# EAGLE board Main_Board (EAGLE 7.7.0)
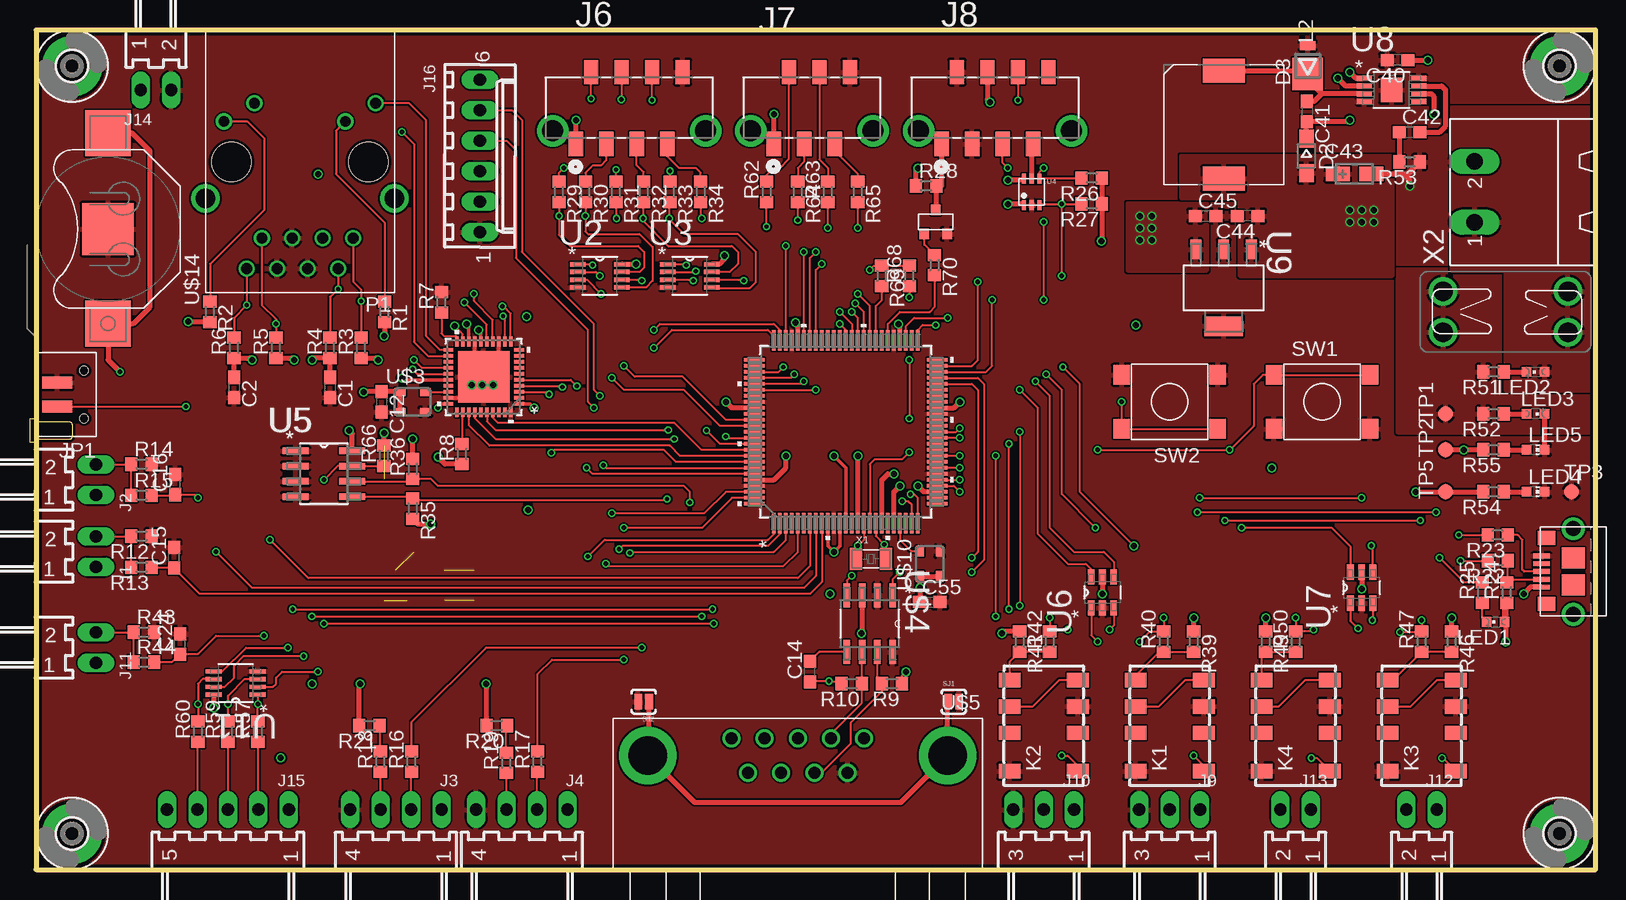
[diagram p5: board, top side]
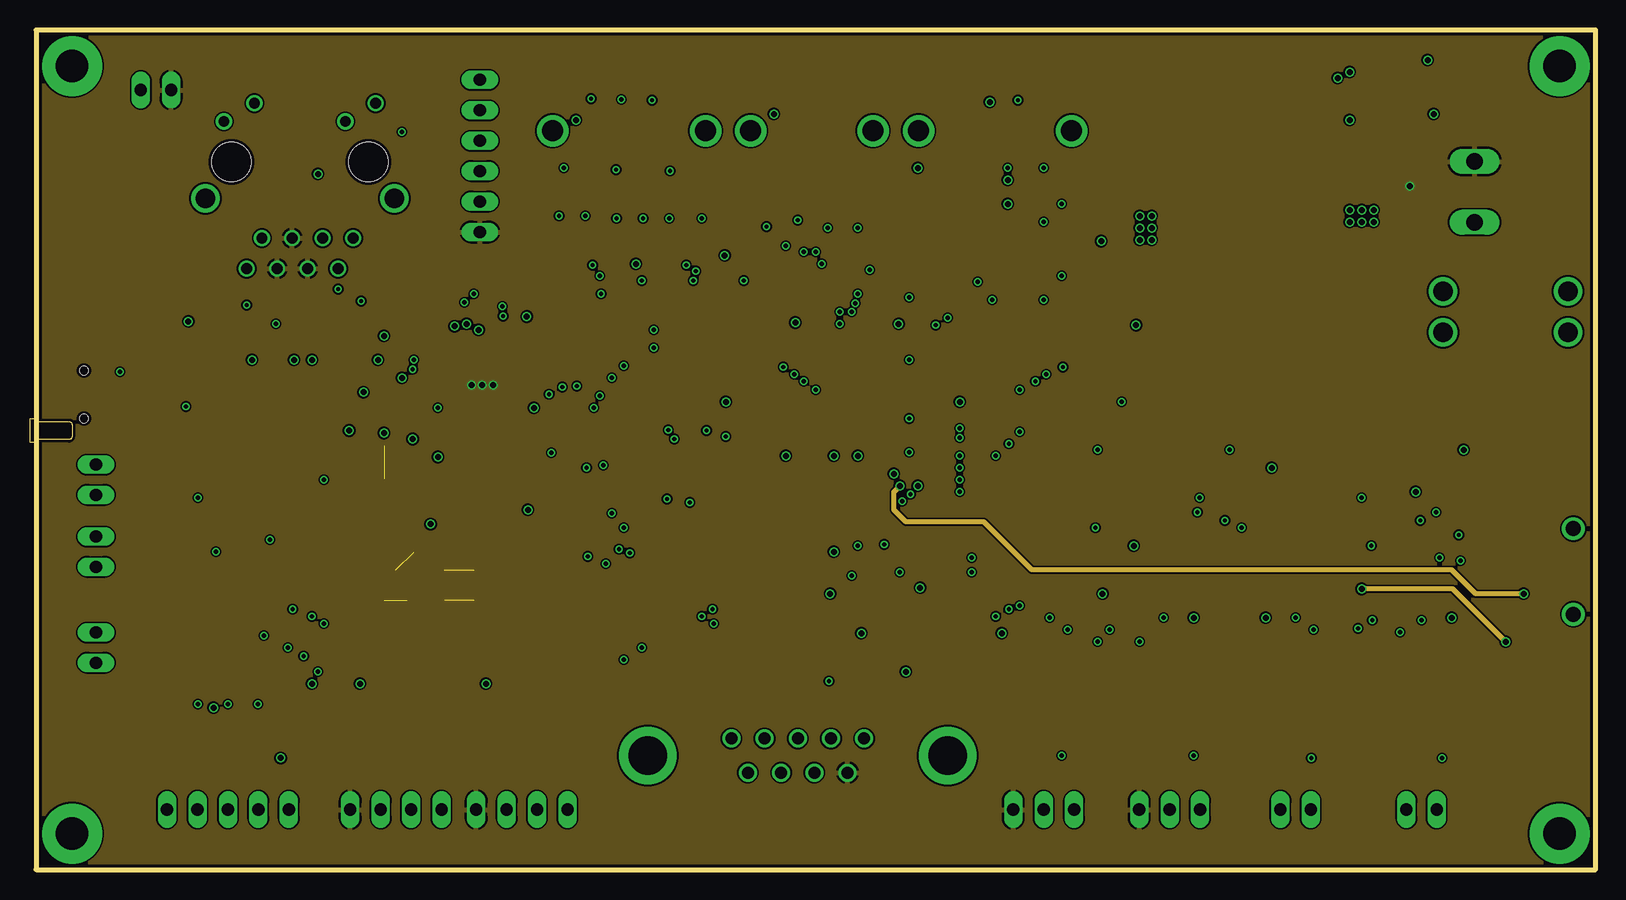
[diagram p6: board, inner layer Route2]
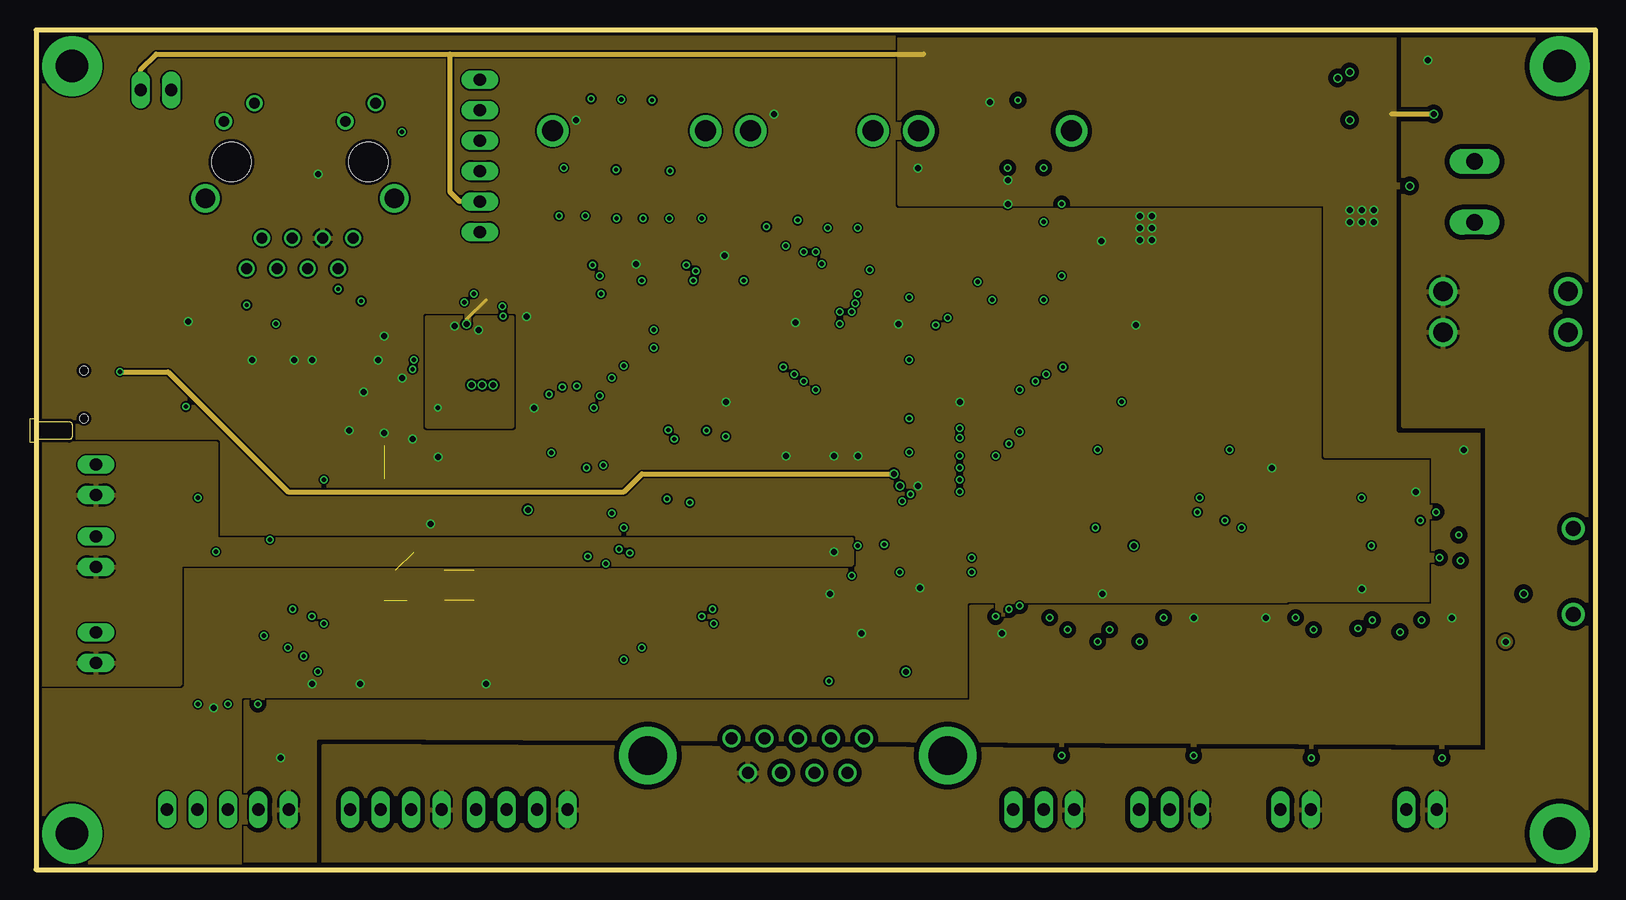
[diagram p7: board, inner layer Route3]
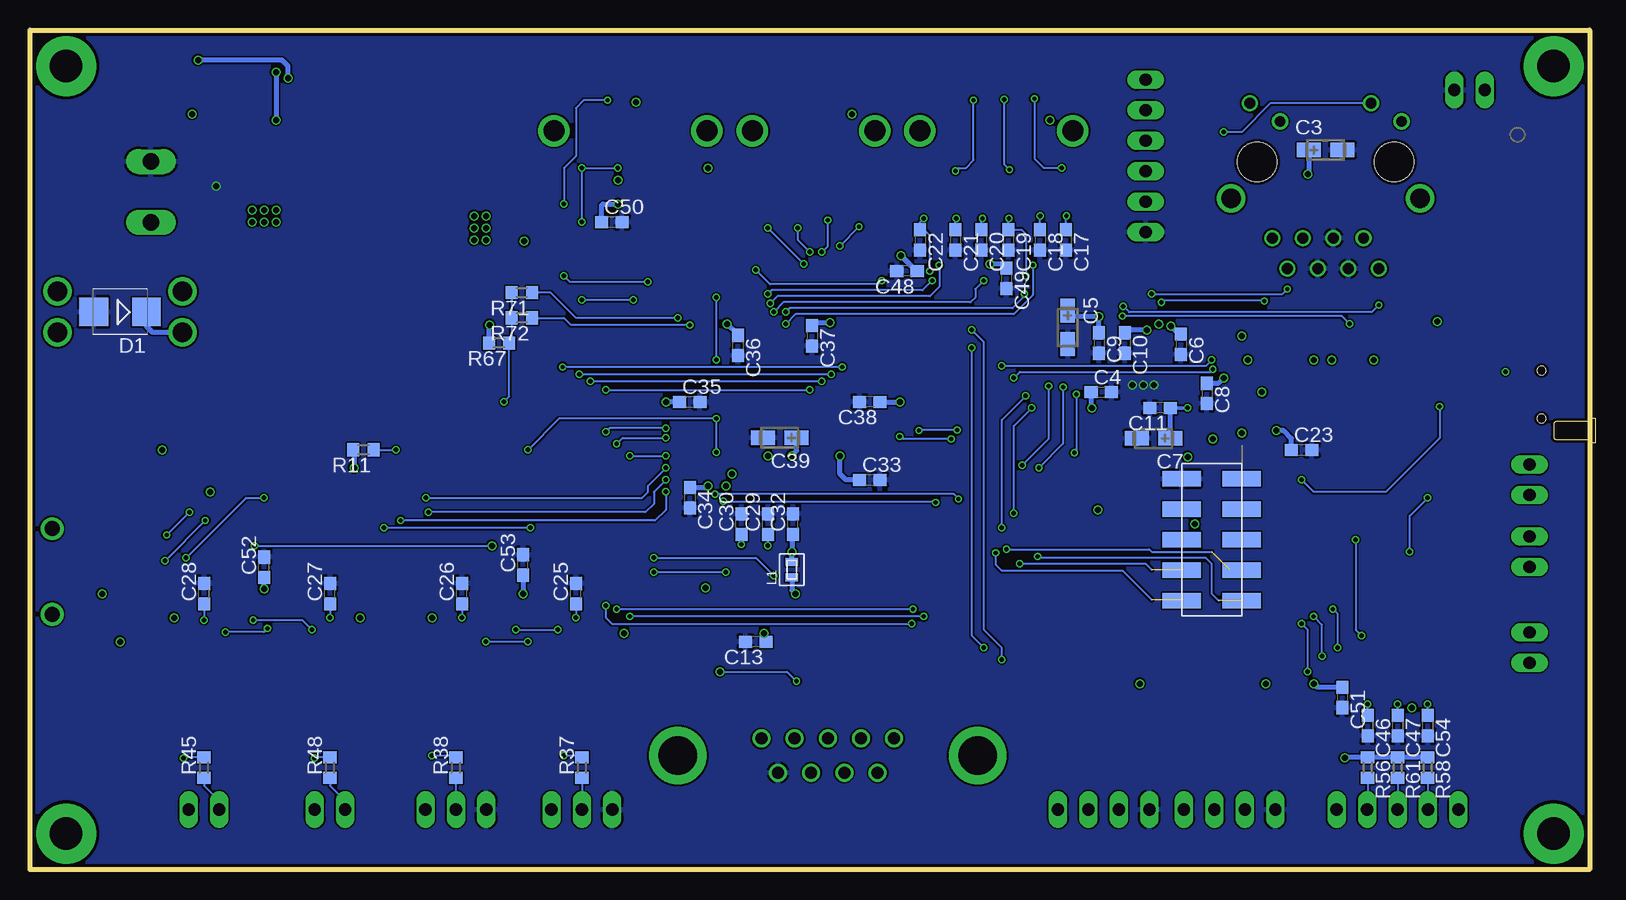
[diagram p8: board, bottom side, seen from below]

Size 130 x 70 mm. Coordinates in mm from the lower left corner, seen from the top.
Outline: 0,0 130,0 130,70 0,70 0,0
Copper layers (1+2*3+16): Top 0.018mm / dielectric 0.36mm / Route2 0.035mm / dielectric 0.71mm / Route3 0.035mm / dielectric 0.36mm / Bottom 0.018mm
Design rules "eC_4Layer_PClass6_BaseCopperO18-I35_eCDefault *": minimum track width 0.15mm, minimum drill 0.35mm, track to track 0.15mm, track to pad 0.15mm, pad to pad 0.15mm, via to via 0.15mm, smd to smd 0mil, copper to edge 0.25mm, drill to drill 0.35mm, minimum pad ring 0.175mm, minimum via ring 0.125mm, stop-mask expansion 0mil, vias tented up to drill 0.45mm, thermal gap 0.2mm
Net classes: 1 signal: width 0.178 mm, drill 0.35 mm; 2 supply: width 0.008 mm, drill 0.5 mm

## Footprints (pad centres in the part's own frame; a part is rotated, then mirrored left to right if it is on the bottom)
C0603 = smd 1.1 x 1: 1 -0.85,0; 2 0.85,0
CT3216 = smd 2 x 1.2: + -1.4,0; - 1.4,0
SMB = smd 2.4 x 2.4: A 2.2,0; C -2.2,0
SOD323-W = smd 1.5 x 1.2: A 1.45,0; C -1.45,0
DO216AA = smd 0.76 x 1.27: A 0.7,0 | smd 2.67 x 2.574: C -1.665,0
3557-LITTLE = drill 1.6: 1 -5.207,-1.702; 2 -5.207,1.702; 3 5.207,-1.702; 4 5.207,1.702
7395-02 = drill 1.016 long: 1 1.27,0; 2 -1.27,0
7395-04 = drill 1.016 long: 1 3.81,0; 2 1.27,0; 3 -1.27,0; 4 -3.81,0
2.54/2X5 = smd 1.27 x 3.2: 1 -5.08,2.5; 2 -5.08,-2.5; 3 -2.54,2.5; 4 -2.54,-2.5; 5 0,2.5; 6 0,-2.5; 7 2.54,2.5; 8 2.54,-2.5; 9 5.08,2.5; 10 5.08,-2.5
MOLEX_90814-0208 = smd 1.194 x 2.007: 1 0,0; 2 1.27,5.994; 3 2.54,0; 4 3.81,5.994; 5 5.08,0; 6 6.35,5.994; 7 7.62,0; 8 8.89,5.994 | drill 1.753: 9 -1.93,1.092; 10 10.82,1.092
MOLEX_90814-0206 = smd 1.194 x 2.007: 1 0,0; 2 1.27,5.994; 3 2.54,0; 4 3.81,5.994; 5 5.08,0; 6 6.35,5.994 | drill 1.753: 7 -1.93,1.092; 8 8.28,1.092
7395-03 = drill 1.016 long: 1 2.54,0; 2 0,0; 3 -2.54,0
7395-05 = drill 1.016 long: 1 5.08,0; 2 2.54,0; 3 0,0; 4 -2.54,0; 5 -5.08,0
6410-06 = drill 1.016 long: 1 6.35,0; 2 3.81,0; 3 1.27,0; 4 -1.27,0; 5 -3.81,0; 6 -6.35,0
BC-2-P = smd 1 x 2.5: 1 -1,-0.75; 2 1,-0.75 | hole 0.7: -2,-3; 2,-3
G6K-2G-Y = smd 1.2 x 1.8: 1 -3.8,-2.85; 2 -0.6,-2.85; 3 1.6,-2.85; 4 3.8,-2.85; 5 3.8,2.85; 6 1.6,2.85; 7 -0.6,2.85; 8 -3.8,2.85
0603 = smd 0.64 x 1.02: P$1 -0.64,0; P$2 0.64,0
WE-PD_1030/1050 = smd 2 x 3.5: 1 -4.5,0; 2 4.5,0
CHIPLED_0603 = smd 0.8 x 0.8: A 0,-0.75; C 0,0.75
CHIP-LED0603 = smd 0.8 x 0.8: A 0,-0.75; C 0,0.75
P2.5 = drill 2.7 pad 5: 1 0,0
WIZNET_RB1-125BAG1A = drill 0.9: L1 6.325,-3.38; L2 3.784,-4.899; L3 -3.786,-3.379; L4 -6.325,-4.9 | drill 0.9 pad 1.3: R1 -4.446,6.349; R2 -3.176,8.889; R3 -1.906,6.349; R4 -0.636,8.889; R5 0.634,6.349; R6 1.904,8.889; R7 3.174,6.349; R8 4.444,8.889 | drill 1.6 pad 2.184: S1 -7.876,3.049; S2 7.874,3.049 | hole 3.3: 5.714,-0.001; -5.716,-0.001
R0603 = smd 1 x 1.1: 1 -0.85,0; 2 0.85,0
SJ_2S-NO = smd 0.635 x 1.27: 1 -0.45,0; 2 0.45,0
B3FS = smd 1.4 x 1.6: 1 4,-2.25; 2 -4,-2.25; 3 4,2.25; 4 -4,2.25
SOT−23 = smd 0.787 x 0.889: 1 0.94,1.003; 2 -0.94,1.003; 3 0,-1.003
B1,27 = smd 1.27 x 1.27: TP 0,0
SOT407-1 = smd 1.727 x 0.279: 1 -7.62,6; 2 -7.62,5.5; 3 -7.62,5; 4 -7.62,4.5; 5 -7.62,4; 6 -7.62,3.5; 7 -7.62,3; 8 -7.62,2.5; 9 -7.62,2; 10 -7.62,1.5; 11 -7.62,1; 12 -7.62,0.5; 13 -7.62,0; 14 -7.62,-0.5; 15 -7.62,-1; 16 -7.62,-1.5; 17 -7.62,-2; 18 -7.62,-2.5; 19 -7.62,-3; 20 -7.62,-3.5; 21 -7.62,-4; 22 -7.62,-4.5; 23 -7.62,-5; 24 -7.62,-5.5; 25 -7.62,-6; 51 7.62,-6; 52 7.62,-5.5; 53 7.62,-5; 54 7.62,-4.5; 55 7.62,-4; 56 7.62,-3.5; 57 7.62,-3; 58 7.62,-2.5; 59 7.62,-2; 60 7.62,-1.5; 61 7.62,-1; 62 7.62,-0.5; 63 7.62,0; 64 7.62,0.5; 65 7.62,1; 66 7.62,1.5; 67 7.62,2; 68 7.62,2.5; 69 7.62,3; 70 7.62,3.5; 71 7.62,4; 72 7.62,4.5; 73 7.62,5; 74 7.62,5.5; 75 7.62,6 | smd 0.279 x 1.727: 26 -6,-7.62; 27 -5.5,-7.62; 28 -5,-7.62; 29 -4.5,-7.62; 30 -4,-7.62; 31 -3.5,-7.62; 32 -3,-7.62; 33 -2.5,-7.62; 34 -2,-7.62; 35 -1.5,-7.62; 36 -1,-7.62; 37 -0.5,-7.62; 38 0,-7.62; 39 0.5,-7.62; 40 1,-7.62; 41 1.5,-7.62; 42 2,-7.62; 43 2.5,-7.62; 44 3,-7.62; 45 3.5,-7.62; 46 4,-7.62; 47 4.5,-7.62; 48 5,-7.62; 49 5.5,-7.62; 50 6,-7.62; 76 6,7.62; 77 5.5,7.62; 78 5,7.62; 79 4.5,7.62; 80 4,7.62; 81 3.5,7.62; 82 3,7.62; 83 2.5,7.62; 84 2,7.62; 85 1.5,7.62; 86 1,7.62; 87 0.5,7.62; 88 0,7.62; 89 -0.5,7.62; 90 -1,7.62; 91 -1.5,7.62; 92 -2,7.62; 93 -2.5,7.62; 94 -3,7.62; 95 -3.5,7.62; 96 -4,7.62; 97 -4.5,7.62; 98 -5,7.62; 99 -5.5,7.62; 100 -6,7.62
SOP65P400X130-8N = smd 1.321 x 0.356: 1 -1.829,0.965; 2 -1.829,0.33; 3 -1.829,-0.33; 4 -1.829,-0.965; 5 1.829,-0.965; 6 1.829,-0.33; 7 1.829,0.33; 8 1.829,0.965
SC-70-DCK = smd 0.35 x 0.85: 1 -0.65,-1.1; 2 0,-1.1; 3 0.65,-1.1; 4 0.65,1.1; 5 0,1.1; 6 -0.65,1.1
SOIC127P600X175-8N = smd 2.184 x 0.559: 1 -2.362,1.905; 2 -2.362,0.635; 3 -2.362,-0.635; 4 -2.362,-1.905; 5 2.362,-1.905; 6 2.362,-0.635; 7 2.362,0.635; 8 2.362,1.905
SOT95P280X145-6N = smd 1.27 x 0.559: 1 -1.295,0.94; 2 -1.295,0; 3 -1.295,-0.94; 4 1.295,-0.94; 5 1.295,0; 6 1.295,0.94
SOP65P490X110-9N = smd 1.245 x 0.432: 1 -2.261,0.965; 2 -2.261,0.33; 3 -2.261,-0.33; 4 -2.261,-0.965; 5 2.261,-0.965; 6 2.261,-0.33; 7 2.261,0.33; 8 2.261,0.965 | smd 1.829 x 2.057: 9 0,0
SOT230P700X180-4N = smd 1.626 x 0.889: 1 -3.2,2.311; 2 -3.2,0; 3 -3.2,-2.311 | smd 1.626 x 3.175: 4 3.2,0
SQA40B = smd 0.813 x 0.305: 1 -2.946,2.25; 2 -2.946,1.75; 3 -2.946,1.25; 4 -2.946,0.75; 5 -2.946,0.25; 6 -2.946,-0.25; 7 -2.946,-0.75; 8 -2.946,-1.25; 9 -2.946,-1.75; 10 -2.946,-2.25; 21 2.946,-2.25; 22 2.946,-1.75; 23 2.946,-1.25; 24 2.946,-0.75; 25 2.946,-0.25; 26 2.946,0.25; 27 2.946,0.75; 28 2.946,1.25; 29 2.946,1.75; 30 2.946,2.25 | smd 0.305 x 0.813: 11 -2.25,-2.946; 12 -1.75,-2.946; 13 -1.25,-2.946; 14 -0.75,-2.946; 15 -0.25,-2.946; 16 0.25,-2.946; 17 0.75,-2.946; 18 1.25,-2.946; 19 1.75,-2.946; 20 2.25,-2.946; 31 2.25,2.946; 32 1.75,2.946; 33 1.25,2.946; 34 0.75,2.946; 35 0.25,2.946; 36 -0.25,2.946; 37 -0.75,2.946; 38 -1.25,2.946; 39 -1.75,2.946; 40 -2.25,2.946 | smd 4.3 x 4.3: 41 0,0
ASE = smd 0.9 x 0.65: 1 -1.05,-0.825; 2 1.05,-0.825; 3 1.05,0.825; 4 -1.05,0.825
SOIC127P600X175-8N' = smd 1.981 x 0.559: 1 -2.362,1.905; 2 -2.362,0.635; 3 -2.362,-0.635; 4 -2.362,-1.905; 5 2.362,-1.905; 6 2.362,-0.635; 7 2.362,0.635; 8 2.362,1.905
5504F1-09S-02A = drill 1: 1 -5.54,-1.42; 2 -2.77,-1.42; 3 0,-1.42; 4 2.77,-1.42; 5 5.54,-1.42; 6 -4.155,1.42; 7 -1.385,1.42; 8 1.385,1.42; 9 4.155,1.42 | drill 3.2: G1 -12.495,0; G2 12.495,0
USB_MICROB_SMT = smd 0.4 x 1.4: 1 -1.3,2.65; 2 -0.65,2.65; 3 0,2.65; 4 0.65,2.65; 5 1.3,2.65 | smd 1.15 x 1.45: 7 -2.7,2.23; 8 2.8,2.23 | smd 1.75 x 1.9: 9 -1.125,0; 10 1.125,0 | drill 1.25 pad 1.9: 11 -3.575,0; 12 3.575,0
3000 = smd 3.81 x 3.81: +1 -7.874,0; +2 8.001,0 | smd 4.318 x 4.318: - 0,0
FC-135 = smd 1 x 1.8: 1 -1.25,0; 2 1.25,0
MSTBA2 = drill 1.397 long: 1 -2.54,5.08; 2 2.54,5.08

## Placement (x,y rotation side)
C1  100nF  [C0603]  24.5,40.2 270 top
C2  100nF  [C0603]  16.5,40.2 270 top
C3  4.7uF  [CT3216]  22,60 0 bottom
C4  100nF  [C0603]  40.7,39.8 0 bottom
C5  10uF  [CT3216]  43.5,45.2 270 bottom
C6  100nF  [C0603]  34.05,43.8 270 bottom
C7  10uF  [CT3216]  36.35,35.95 180 bottom
C8  100nF  [C0603]  31.9,39.7 270 bottom
C9  100nF  [C0603]  40.9,43.9 270 bottom
C10  100nF  [C0603]  38.75,43.9 270 bottom
C11  100nF  [C0603]  35.8,38.5 180 bottom
C12  100nF  [C0603]  28.8,39 270 top
C13  100nF  [C0603]  69.5,19 180 bottom
C14  4700pF  [C0603]  64.5,16.5 90 top
C15  4.7uF  [C0603]  11.5,26 90 top
C16  4.7uF  [C0603]  11.6,32.1 90 top
C17  0.1uF  [C0603]  43.65,52.5 270 bottom
C18  0.1uF  [C0603]  45.8,52.5 270 bottom
C19  0.1uF  [C0603]  48.45,52.5 270 bottom
C20  0.1uF  [C0603]  50.7,52.5 270 bottom
C21  0.1uF  [C0603]  52.85,52.5 270 bottom
C22  0.1uF  [C0603]  55.8,52.5 270 bottom
C23  0.1uF  [C0603]  24,35 0 bottom
C24  4.7uF  [C0603]  12,18.8 90 top
C25  0.1uF  [C0603]  84.5,23 90 bottom
C26  0.1uF  [C0603]  94,23 90 bottom
C27  0.1uF  [C0603]  105,23 90 bottom
C28  0.1uF  [C0603]  115.5,23 90 bottom
C29  18pF  [C0603]  68.5,28.8 90 bottom
C30  18pF  [C0603]  70.7,28.8 90 bottom
C32  0.1uF  [C0603]  66.4,28.8 90 bottom
C33  0.1uF  [C0603]  60,32.5 0 bottom
C34  0.1uF  [C0603]  75,31 270 bottom
C35  0.1uF  [C0603]  75,39 0 bottom
C36  0.1uF  [C0603]  71,43.7 270 bottom
C37  0.1uF  [C0603]  64.8,44.5 270 bottom
C38  0.1uF  [C0603]  60,39 180 bottom
C39  10uF  [CT3216]  67.5,36 180 bottom
C40  2.2uF  [C0603]  113.5,67.5 180 top
C41  0.1uF  [C0603]  105.95,63.2 270 top
C42  0.1uF  [C0603]  114.5,61.5 0 top
C43  10uF  [CT3216]  109.9,58 0 top
C44  1uF  [C0603]  101,54.5 180 top
C45  1uF  [C0603]  97.5,54.5 0 top
C46  0.1uF  [C0603]  18.5,12 270 bottom
C47  0.1uF  [C0603]  16,12 270 bottom
C48  0.1uF  [C0603]  56.9,49.9 180 bottom
C49  0.1uF  [C0603]  48.6,49.3 270 bottom
C50  0.1uF  [C0603]  81.5,54 0 bottom
C51  0.1uF  [C0603]  20.6,14.35 270 bottom
C52  0.1uF  [C0603]  110.5,25.2 90 bottom
C53  0.1uF  [C0603]  88.9,25.4 90 bottom
C54  0.1uF  [C0603]  13.5,12 270 bottom
C55  0.1uF  [C0603]  74.5,22.3 0 top
D1  [SMB]  122.5,46.5 180 bottom
D2  CMDSH2-3  [SOD323-W]  105.9,59.5 270 top
D3  USB120  [DO216AA]  106,68 90 top
F1  FUSE3557L  [3557-LITTLE]  122.5,46.5 180 top
J1  22-05-7028-02  [7395-02]  5,26.5 270 top
J2  22-05-7028-02  [7395-02]  5,32.5 270 top
J3  22-05-7048-04  [7395-04]  30,5 0 top
J4  22-05-7048-04  [7395-04]  40.5,5 0 top
J5  1241050-5  [2.54/2X5]  31.5,27.5 270 bottom
J6  90814-0208  [MOLEX_90814-0208]  45,60.5 0 top
J7  90814-0206  [MOLEX_90814-0206]  61.5,60.5 0 top
J8  90814-0208  [MOLEX_90814-0208]  75.5,60.5 0 top
J9  22-05-7038-03  [7395-03]  94.5,5 0 top
J10  22-05-7038-03  [7395-03]  84,5 0 top
J11  22-05-7028-02  [7395-02]  5,18.5 270 top
J12  22-05-7028-02  [7395-02]  115.5,5 0 top
J13  22-05-7028-02  [7395-02]  105,5 0 top
J14  22-05-7028-02  [7395-02]  10,65 180 top
J15  22-05-7058-05  [7395-05]  16,5 0 top
J16  22-27-2061-06  [6410-06]  37,59.5 270 top
JP1  BC-2-P  [BC-2-P]  1,39.6 90 top
K1  G6K-2G-Y  [G6K-2G-Y]  94.5,12 90 top
K2  G6K-2G-Y  [G6K-2G-Y]  84,12 90 top
K3  G6K-2G-Y  [G6K-2G-Y]  115.5,12 90 top
K4  G6K-2G-Y  [G6K-2G-Y]  105,12 90 top
L1  0603PS-103KLB  [0603]  66.5,25 90 bottom
L2  4.7uF  [WE-PD_1030/1050]  99,62.1 270 top
LED1  [CHIPLED_0603]  121.65,20.65 90 top
LED2  Red  [CHIPLED_0603]  125,41.5 90 top
LED3  Red  [CHIPLED_0603]  125,38 270 top
LED4  Green  [CHIP-LED0603]  125,31.5 270 top
LED5  Green  [CHIP-LED0603]  125,35 270 top
MP1  MOUNT-PAD2.5  [P2.5]  3,67 0 top
MP2  MOUNT-PAD2.5  [P2.5]  127,67 0 top
MP3  MOUNT-PAD2.5  [P2.5]  3,3 0 top
MP4  MOUNT-PAD2.5  [P2.5]  127,3 0 top
P1  RB1-125BAG1A  [WIZNET_RB1-125BAG1A]  22,59 180 top
R1  220  [R0603]  29.05,46.5 270 top
R2  220  [R0603]  14.5,46.5 270 top
R3  49.9  [R0603]  27.1,43.5 90 top
R4  49.9  [R0603]  24.5,43.5 90 top
R5  49.9  [R0603]  20,43.5 90 top
R6  49.9  [R0603]  16.5,43.5 90 top
R7  4K87  [R0603]  33.8,47.3 90 top
R8  4K7  [R0603]  35.5,34.65 90 top
R9  60  [R0603]  71.35,15.5 180 top
R10  60  [R0603]  68,15.5 180 top
R11  10K  [R0603]  102.2,35 180 bottom
R12  10k  [R0603]  8.8,27.8 180 top
R13  10k  [R0603]  8.8,25.2 180 top
R14  10k  [R0603]  8.8,33.8 0 top
R15  10k  [R0603]  8.8,31.2 0 top
R16  1K  [R0603]  31.3,9 90 top
R17  100  [R0603]  41.8,9 90 top
R18  100  [R0603]  28.7,9 90 top
R19  100  [R0603]  39.2,8.9 90 top
R20  10k  [R0603]  38.4,12 180 top
R21  10k  [R0603]  27.8,12 180 top
R22  33  [R0603]  121.85,25.75 180 top
R23  33  [R0603]  121.85,27.9 180 top
R24  1k5  [R0603]  122.6,23.1 90 top
R25  1k5  [R0603]  120.55,23.1 90 top
R26  4k7  [R0603]  88,57.65 180 top
R27  4k7  [R0603]  88,55.5 180 top
R28  33  [R0603]  74.2,57 0 top
R29  1k  [R0603]  43.6,56.5 270 top
R30  1k  [R0603]  45.8,56.5 270 top
R31  1k  [R0603]  48.35,56.5 270 top
R32  1k  [R0603]  50.65,56.5 270 top
R33  1k  [R0603]  52.85,56.5 270 top
R34  1k  [R0603]  55.4,56.5 270 top
R35  4k7  [R0603]  31.4,30.1 270 top
R36  4k7  [R0603]  31.4,33.4 90 top
R37  100  [R0603]  84,8.5 90 bottom
R38  100  [R0603]  94.5,8.5 90 bottom
R39  4k7  [R0603]  96.5,19 270 top
R40  100  [R0603]  94,19 90 top
R41  4k7  [R0603]  82,19 270 top
R42  100  [R0603]  84.5,19 90 top
R43  10k  [R0603]  9,19.8 0 top
R44  10k  [R0603]  9,17.3 0 top
R45  100  [R0603]  115.5,8.5 90 bottom
R46  4k7  [R0603]  118,19 270 top
R47  100  [R0603]  115.5,19 90 top
R48  100  [R0603]  105,8.5 90 bottom
R49  4k7  [R0603]  102.5,19 270 top
R50  100  [R0603]  105,19 90 top
R51  4k7  [R0603]  121.5,41.5 180 top
R52  4k7  [R0603]  121.5,38 180 top
R53  4k7  [R0603]  114.5,59 180 top
R54  1k5  [R0603]  121.5,31.5 180 top
R55  1k5  [R0603]  121.5,35 180 top
R56  4k7  [R0603]  18.5,8.5 270 bottom
R57  100  [R0603]  18.5,11.5 90 top
R58  4k7  [R0603]  13.5,8.5 270 bottom
R59  100  [R0603]  16,11.5 90 top
R60  100  [R0603]  13.5,11.5 90 top
R61  4k7  [R0603]  16,8.5 270 bottom
R62  100  [R0603]  60.9,56.5 90 top
R63  100  [R0603]  66,56.5 90 top
R64  100  [R0603]  63.5,56.5 270 top
R65  100  [R0603]  68.5,56.5 270 top
R66  4k7  [R0603]  29,34.5 90 top
R67  10K  [R0603]  90.9,43.9 180 bottom
R68  0R  [R0603]  72.8,49.5 90 top
R69  0R  [R0603]  70.5,49.5 270 top
R70  100  [R0603]  74.9,50.4 270 top
R71  0R  [R0603]  89,48.1 180 bottom
R72  0R  [R0603]  89,46 180 bottom
SJ1  SOLDERJUMPERNO  [SJ_2S-NO]  76.5,14 0 top
SJ2  SOLDERJUMPERNO  [SJ_2S-NO]  50.65,14 180 top
SW1  B3FS-1015  [B3FS]  107.2,39 0 top
SW2  B3FS-1015  [B3FS]  94.5,39 180 top
T1  MMBT2222AL  [SOT−23]  75,54 180 top
TP1  TPB1,27  [B1,27]  117.5,38 90 top
TP2  TPB1,27  [B1,27]  117.5,35 90 top
TP3  TPB1,27  [B1,27]  128,31.5 0 top
TP5  TPB1,27  [B1,27]  117.5,31.5 90 top
U1  LPC1768FBD100  [SOT407-1]  67.5,36.5 90 top
U2  SN74LVC3G17DCTR  [SOP65P400X130-8N]  47,49.5 0 top
U3  SN74LVC3G17DCTR  [SOP65P400X130-8N]  54.5,49.5 0 top
U4  TPL0401A  [SC-70-DCK]  83,56.5 0 top
U5  AT24C512C-SSHM-B  [SOIC127P600X175-8N]  24,33 0 top
U6  SN74LVC2G17DBVR  [SOT95P280X145-6N]  88.9,23.1 90 top
U7  SN74LVC2G17DBVR  [SOT95P280X145-6N]  110.5,23.5 90 top
U8  LT1767EMS8E-5PBF  [SOP65P490X110-9N]  113,65 0 top
U9  TC1264-3.3  [SOT230P700X180-4N]  99,48.5 270 top
U11  SN74LVC3G17DCTR  [SOP65P400X130-8N]  16.65,15.55 180 top
U$1  EXMACHINA-LOGO-NAME  [EXM-LOGO-BASELINE]  178.61,1.49 0 top  (outside the outline)
U$2  DP83848JSQ/NOPB  [SQA40B]  37.32,41.07 180 top
U$3  ASE_50  [ASE]  31.4,39 0 top
U$4  MCP2561-E/SN  [SOIC127P600X175-8N']  69.5,20.5 270 top
U$5  5504F1-09S-02A-03  [5504F1-09S-02A]  63.5,9.5 180 top
U$6  USB3075-30-A  [USB_MICROB_SMT]  128.15,24.85 90 top
U$9  [A4L-LOC]  -59,-24 0 top  (outside the outline)
U$10  ASE-12  [ASE]  74.5,25.5 90 top
U$14  3000  [3000]  6,53.4 90 top
X1  FC-135  [FC-135]  69.6,25.9 0 top
X2  MSTBA2  [MSTBA2]  125,56.5 90 top

## Tracks (layer width: path | path; a pad name or v marks a point on that pad's centre or on a via)
+3V3  (via drill 0.5)  (1 unrouted)
  Top 0.305: U$2.1 41.18,38.82 v41.5,38.5 | U1.13 67.5,33.5 v66.5,34.5 | U$2.26 30.68,40.82 v30.5,41 | U$2.18 36.07,45.33 v35.9,45.5
  Top 0.406: U11.8 14.82,13.52 v14.8,13.5 | J6.1 v45,62.5 | J7.1 v61.5,63 | R21.2 26.95,15.45 v27,15.5 | R20.2 37.55,15.45 v37.5,15.5 | U3.8 56.36,50.5 57,50.5 57.4,50.9 v57.4,51.2 | U2.8 48.86,50.5 v50,50.5 | R26.1 R27.1 88.85,52.45 v88.8,52.4 | R1.2 29.05,44.55 v29,44.5 | v18,42.5 17.85,42.65 R6.1 C2.1 | R5.1 21.35,42.65 v21.5,42.5 | v23,42.5 23.15,42.65 R4.1 C1.1 | R3.1 28.35,42.65 v28.5,42.5 | v27.3,39.8 27.35,39.85 C12.1 30.32,39.85 U$3.4 U$3.1 | U$4.3 68.86,19.77 v68.8,19.7 | U6.5 v88.9,23 | U7.5 v110.5,23.4 | 73.7,24.43 v73.7,23.5 73.7,22.35 C55.1 | 73.7,24.43 U$10.4 | R2.2 12.75,45.65 v12.7,45.7 | R36.2 v31.4,35.9 | R66.2 v29,36.4 | U5.8 26.36,36.34 v26.1,36.6 | R35.2 31.85,28.8 v32.9,28.8 | U1.84 58,38.5 v57.5,39 | U1.71 63.5,45.4 v63.3,45.6 | U1.54 72,45.4 v71.9,45.5 | U1.42 76.5,38.5 v77,39 | U1.28 74,31.5 v73.5,32 | U1.96 61.5,32.5 62.5,33.5 v62.5,34.5 | U1.15 v68.5,34.5 | LED1.A 122.4,22.05 R24.1 122.5,22.15 v122.5,19 | v115,31.5 TP5.TP R54.2 | R8.1 34.1,33.8 v33.5,34.4 | 73.7,24.43 75.3,24.43 U$10.1
  Route2 0.406: v122.5,19 118.1,23.4 v110.5,23.4
  Route3 0.305: v35.9,45.5 35.9,45.9 37.5,47.5
  Bottom 0.406: C51.1 22.7,15.2 v23,15.5 | 57.35,51.2 v57.4,51.2 56.1,49.9 C48.1 | C49.1 48.95,50.5 v50,50.5 | C3.+ 23.4,58.1 v23.5,58 | v68.8,19.7 68.8,19.15 C13.1 | v110.5,23.4 C52.1 | C53.1 v88.9,23 | R67.2 91.75,45.35 v91.7,45.4 | R11.2 103,34.95 v103,33.5 | C23.1 24.85,35.95 25.5,36.6 v26.1,36.6 | C33.1 62,32.5 62.5,33 v62.5,34.5 | C34.1 73.65,31.85 v73.5,32 | C36.1 71,44.6 v71.9,45.5 | C37.1 64.55,45.6 v63.3,45.6 | C35.1 v77,39 | C38.1 v57.5,39 | v66.5,34.5 66.1,34.9 C39.+ | C4.1 41.55,38.55 v41.5,38.5 | C8.1 30.95,40.55 v30.5,41 | C9.1 v40.9,46.1 43,46.1 C5.+ | L1.P$1 66.5,23.3 v66.2,23
  other vias: 92,54.5 92,53.5 92,52.5 93,52.5 93,53.5 93,54.5
  pour Route3 (rank 6): -11,73.5 135.5,73.5 135.5,-4 -11,-4
  pour Top (rank 3): 97.6,55.5 91,55.5 91,50 97.6,50
+5V  (via drill 0.5)
  Top 0.406: J8.4 79.31,64.19 v79.5,64 | R55.2 v119,35 TP2.TP | R49.1 v102.5,21 | R46.1 v118,21 | R39.1 v96.5,21 | U4.6 82.25,57.5 v81,57.5 | U4.1 82.25,55.5 v81,55.5 | R28.1 73.35,58.35 v73.5,58.5 | R41.1 80.65,19.85 v80.5,19.7 | U8.6 116.33,64.67 116.5,64.5 v116.5,63
  Route3 0.406: v116.5,63 113,63 | J14.1 8.73,66.73 10,68 34.5,68 | 34.5,68 74,68 | J16.2 35.31,55.69 34.5,56.5 34.5,68
  Bottom 0.406: R58.1 R61.1 R56.1 20.35,9.35 v20.4,9.3 | C50.1 U4.1 82.25,55.5 v81,55.5
  other vias: 109.5,55 110.5,55 109.5,54 110.5,54 111.5,54 111.5,55
  pour Route3 (isolate 0.406, rank 2): 72,70.5 137.5,70.5 137.5,-8.5 17.5,-8 17.5,14 78,14 78,21.9 104.5,21.9 104.6,22 116.5,22 116.5,34.5 107.5,34.5 107.5,55.5 72,55.5
  pour Top (rank 2): 95.5,59.5 113,59.5 113,49.5 100.4,49.5 100.4,56 95.5,56
+24V  (via drill 0.5)
  Top 0.406: C40.1 v116,67.5 | U8.2 109.17,65.33 v108.5,66
  Bottom 0.406: D1.C 120.3,45.3 119.8,44.8 F1.4 | v108.5,66 108.5,67 109,67.5 v116,67.5
  pour Route3 (isolate 0.406): 142,-1.5 24,-1 24,10.3 121,9.8 121,37 114,37 114,70.5 141.5,70.5
  pour Top (rank 3): 113.5,36.5 134,36.5 133.5,50 113.5,50
ADC_SLACK_DETECTION  (via drill 0.35)
  Top 0.178: U1.7 64.5,25.3 63.5,24.3 22.7,24.3 v19.5,27.5 | R44.2 11.35,17.3 C24.1 12.05,18 13.5,18 15,19.5 v19,19.5
  Bottom 0.178: v19.5,27.5 19.5,20 v19,19.5
ADC_TEMP_0
  Top 0.178: R13.1 11.45,25.2 C15.1 arc90 11.65,25 13.65,23 64.5,23 65.5,24 U1.9
ADC_TEMP_1  (via drill 0.35)
  Top 0.178: R15.2 11.55,31.2 C16.1 13.25,31.25 v13.5,31 | U1.8 65,24.5 64,23.5 18,23.5 v15,26.5
  Bottom 0.178: v15,26.5 15,29.5 v13.5,31
AVDD  (via drill 0.5)
  Top 0.305: U1.10 66,27 v66.5,26.5 67,27 U1.12
  Bottom 0.406: C32.1 66.5,28.05 v66.5,26.5 L1.P$2
  pour Route3: -1,35.5 -1,15.5 12,15.5 12,25.5 68,25.5 68,27.5 15,27.5 15,35.5
BOOT_SELECT_P2_10  (via drill 0.35)
  Top 0.178: U1.53 72.5,45.3 73.2,46 v76,46
  Bottom 0.178: v76,46 84.5,46 86.6,48.1 R71.1
BOOT_SELECT_P2_12  (via drill 0.35)
  Top 0.178: U1.51 73.5,45 73.9,45.4 v75,45.4
  Bottom 0.178: v75,45.4 84.9,45.4 85.5,46 R72.1
BRAKE_SENSOR_1  (via drill 0.35)
  Top 0.178: U1.81 v65,40 | v82,40 83.5,38.5 83.5,28 86,25.5 87.5,25.5 88,25 88,24.43 U6.6
  Bottom 0.178: v82,40 v65,40
BRAKE_SENSOR_2  (via drill 0.35)
  Top 0.178: v64,40.7 63.8,40.5 U1.80 59.5,40.5 | v83.3,40.7 84.5,39.5 84.5,28.5 86.5,26.5 89,26.5 89.84,25.66 U6.4
  Bottom 0.178: v64,40.7 v83.3,40.7
CAN_H
  Top 0.178: U$5.7 65.48,8.08 67.9,10.5 67.9,12.25 70.5,14.85 R9.2 70.14,15.87 U$4.7
CAN_L
  Top 0.178: U$5.2 66.27,11.32 68.85,13.9 R10.1 68.86,15.52 U$4.6
CAN_RX  (via drill 0.35)
  Top 0.178: U1.46 78,40.5 78.5,40 78.5,26.5 v78,26 | v68,24.5 67.59,24.09 U$4.4
  Bottom 0.178: v78,26 69.5,26 v68,24.5
CAN_SPLIT
  Top 0.178: U$4.5 65.29,18.14 C14.2
CAN_TX  (via drill 0.35)
  Top 0.178: U1.47 78.5,41 79,40.5 79,25.8 v78,24.8 | v72,24.8 71.41,24.2 U$4.1
  Bottom 0.178: v78,24.8 v72,24.8
DRIVE_EN  (via drill 0.35)
  Top 0.178: v100.5,28.5 108,28.5 109.56,26.94 U7.6 | v63.2,41.3 62.9,41 U1.79 | v84.2,41.3 85.5,40 85.5,31.3 v88.3,28.5
  Bottom 0.178: v88.3,28.5 v100.5,28.5 | v84.2,41.3 v63.2,41.3
DRIVE_ERR  (via drill 0.35, 0.5)
  Top 0.178: U1.78 61.9,41.5 v62.3,41.9 | v85.6,41.9 87,40.5 87,31.5 v91.5,27 | U7.4 111.44,26.86 v111.3,27
  Bottom 0.178: v111.3,27 v91.5,27 | v62.3,41.9 v85.6,41.9
EEPROM_SCL  (via drill 0.35)
  Top 0.178: U5.6 31.21,32.37 R36.1 32.95,32.55 33.5,32 54,32 54.5,31.5 v54.5,30.6 | U1.24 73,30.4 72.7,30.7 v72.2,30.7
  Bottom 0.178: v72.2,30.7 54.5,30.7 v54.5,30.6
EEPROM_SDA  (via drill 0.35)
  Top 0.178: U5.5 31.25,31.09 R35.1 31.55,30.8 52.5,30.8 v52.6,30.9 | U1.25 73.5,31 73.2,31.3 v72.9,31.3
  Bottom 0.178: v52.6,30.9 53,31.3 v72.9,31.3
ENCODER_A  (via drill 0.35)
  Top 0.178: U11.7 15.72,15.22 16.5,16 16.5,17 17.3,17.8 v22.3,17.8 | v23,21.1 v55.5,21.1 | v80,21.1 v80,34.5 | v77,34.5 U1.34
  Bottom 0.178: v55.5,21.1 v80,21.1 | v80,34.5 v77,34.5 | v22.3,17.8 22.3,20.4 v23,21.1
ENCODER_B  (via drill 0.35)
  Top 0.178: U11.5 15.52,16.52 17.5,18.5 v21,18.5 | v21.4,21.7 v56.4,21.7 | v81.1,21.7 v81.1,35.5 | v77,36 U1.37
  Bottom 0.178: v56.4,21.7 v81.1,21.7 | v81.1,35.5 80.6,36 v77,36 | v21,18.5 21,21.3 v21.4,21.7
ENCODER_Z  (via drill 0.35)
  Top 0.178: U11.2 19.72,15.22 20,15.5 20,16 20.5,16.5 v23.5,16.5 | U1.38 76.7,36.5 v77,36.8 | v82,36.5 v82,22 | v56.5,20.5 v24,20.5
  Bottom 0.178: v23.5,16.5 23.5,20 v24,20.5 | v77,36.8 81.7,36.8 v82,36.5 | v56.5,20.5 81.5,20.5 82,21 v82,22
ETH_CRS
  Top 0.178: U1.92 53.7,34.5 52.85,35.35 37.8,35.35 36.07,37.08 U$2.33
ETH_MDC  (via drill 0.35)
  Top 0.178: U1.87 57,37 54,40 49,40 v48,41 | U$2.25 31.78,41.32 v31.4,41.7
  Bottom 0.178: v48,41 47.5,41.5 31.6,41.5 v31.4,41.7
ETH_MDIO  (via drill 0.35)
  Top 0.178: U1.86 57.5,37.5 53.9,41.1 49.9,41.1 v49,42 | U$2.24 32.18,41.82 v31.5,42.5
  Bottom 0.178: v31.5,42.5 32,42 v49,42
ETH_RX_ER  (via drill 0.35)
  Top 0.178: U$2.34 36.57,37.63 38.3,35.9 v53.2,35.9 | v57.5,36.1 57.6,36 U1.89
  Bottom 0.178: v53.2,35.9 57.3,35.9 v57.5,36.1
ETH_RX_N  (via drill 0.35)
  Top 0.178: P1.R8 v17.56,47.06 16.5,46 R6.2 | U$2.11 39.57,46.36 38.97,46.96 v38.87,46.96
  Bottom 0.178: v38.87,46.96 38.37,46.46 18.15,46.46 v17.56,47.06
ETH_RX_P  (via drill 0.35)
  Top 0.178: P1.R7 18.83,47.07 20,45.9 v20,45.5 R5.2 | v38.93,46.14 39.07,46 U$2.12
  Bottom 0.178: v38.93,46.14 20.64,46.14 v20,45.5
ETH_RXD_N
  Top 0.178: U1.91 55.46,35 53.2,37.26 38.49,37.26 38.07,37.68 U$2.37
ETH_RXD_P  (via drill 0.35)
  Top 0.178: U$2.36 37.59,38.12 37.59,37.35 38.31,36.64 v52.7,36.64 | U1.90 57,35.5 v55.9,36.6
  Bottom 0.178: v55.9,36.6 55.86,36.64 v52.7,36.64
ETH_TX_N  (via drill 0.35)
  Top 0.178: P1.R2 v25.18,48.41 24.5,47.73 R4.2 | U$2.14 38.07,45.83 36.5,47.4 v36.5,48
  Bottom 0.178: v36.5,48 25.58,48 v25.18,48.41
ETH_TX_P  (via drill 0.35)
  Top 0.178: P1.R1 26.45,49.01 27.1,48.36 v27.1,47.4 R3.2 | U$2.15 37.57,45.43 v35.7,47.3
  Bottom 0.178: v35.7,47.3 35.5,47.5 27.2,47.5 v27.1,47.4
ETH_TXD_EN  (via drill 0.35)
  Top 0.178: U1.93 53.35,34 52.35,35 43.2,35 v42.95,34.75 | U$2.3 42.58,39.82 v42.78,39.62
  Bottom 0.178: v42.78,39.62 42.78,34.92 v42.95,34.75
ETH_TXD_N  (via drill 0.35)
  Top 0.178: U1.95 46.4,33 v45.9,33.5 | U$2.4 43.78,40.32 v43.88,40.22
  Bottom 0.178: v43.88,40.22 43.88,35.52 v45.9,33.5
ETH_TXD_P  (via drill 0.35)
  Top 0.178: U1.94 47.5,33.5 v47.3,33.7 | U$2.5 44.58,40.82 v45.08,40.32
  Bottom 0.178: v45.08,40.32 45.08,35.92 v47.3,33.7
ETH_X1
  Top 0.178: U$2.28 U$3.3
FAN_1_PWM  (via drill 0.35)
  Top 0.178: R16.2 31.3,12.3 37.5,18.5 v50.5,18.5 | U1.75 61.5,44.5 61,45 53,45 v51.5,43.5
  Bottom 0.178: v50.5,18.5 51.5,19.5 v51.5,43.5
FAN_1_SENSOR
  Top 0.178: R18.2 28.7,11.95 R21.1
FAN_2_PWM  (via drill 0.35)
  Top 0.178: U1.74 62,45 61.5,45.5 52,45.5 v51.5,45 | R17.2 41.8,16.3 43,17.5 v49,17.5
  Bottom 0.178: v49,17.5 49,18.5 50.5,20 50.5,44 v51.5,45
FAN_2_SENSOR
  Top 0.178: R19.2 39.2,11.95 R20.1
GND  (via drill 0.5)
  Top 0.305: U$2.13 38.57,43.07 38.5,43 | U$2.17 36.57,43.07 36.5,43 | U$2.29 36.3,39.32 v36.3,40.4
  Top 0.406: LED5.C LED3.C | R53.1 114.35,58 114,58 | 114,58 C43.- | v114.5,57 114.5,57.5 114,58 | 38.57,43.07 38.57,40.4 v38.1,40.4 | 36.57,43.07 36.57,43 36.5,43 36.5,40.4 v36.3,40.4
  other vias: 37.2,40.4
  pour Bottom (rank 6): -9.5,72.5 134.5,72.5 134.5,-2.5 -9.5,-2.5
  pour Top (rank 6): -13,75.5 138.5,75.5 138.5,-6.5 -13,-6.5
  pour Route2 (rank 6): -12,74.5 137,74.5 137,-5.5 -12,-5.5 -12,74
HMI_BUTTON_1  (via drill 0.35)
  Top 0.178: R29.1 43.6,58.1 v44,58.5 | v46.27,64.27 J6.2
  Bottom 0.178: v44,58.5 45.5,58.5 46.27,59.27 v46.27,64.27
HMI_BUTTON_2
  Top 0.178: J6.3 47.54,59.14 47.1,58.7 46.4,58.7 45.8,58.1 R30.1
HMI_BUTTON_3  (via drill 0.35)
  Top 0.178: R31.1 v48.35,58.35 | J6.4 v48.8,64.2
  Bottom 0.178: v48.35,58.35 48.81,58.81 v48.81,64.19 v48.8,64.2
HMI_BUTTON_4
  Top 0.178: R32.1 50.65,58.15 50.08,58.72 J6.5
HMI_BUTTON_5  (via drill 0.35)
  Top 0.178: R33.1 v52.85,58.25 | v51.35,64.15 J6.6
  Bottom 0.178: v52.85,58.25 52.6,58.5 52,58.5 51.35,59.15 v51.35,64.15
HMI_BUTTON_6
  Top 0.178: R34.1 55.4,58.1 55,58.5 53.6,58.5 52.62,59.48 J6.7
HMI_BUTTON_CPU_1  (via drill 0.35)
  Top 0.178: U2.1 46.34,50.47 v46.4,50.4 | v67,45.5 67.5,45 U1.63
  Bottom 0.178: v46.4,50.4 46.4,47.9 48,46.3 66.2,46.3 v67,45.5
HMI_BUTTON_CPU_2  (via drill 0.35)
  Top 0.178: U2.3 45.93,49.17 v47.1,48 | v67,46.5 68,45.5 U1.62
  Bottom 0.178: v47.1,48 47.1,47.8 48.1,46.8 66.7,46.8 v67,46.5
HMI_BUTTON_CPU_3  (via drill 0.35)
  Top 0.178: U1.61 68.5,46 v68,46.5 | U2.6 50.43,49.17 v50.5,49.1
  Bottom 0.178: v68,46.5 67.2,47.3 51.6,47.3 51.2,47.7 51.2,48.4 v50.5,49.1
HMI_BUTTON_CPU_4  (via drill 0.35)
  Top 0.178: U1.60 69,46.5 v68.3,47.2 | U3.1 54.13,50.47 v54.2,50.4
  Bottom 0.178: v54.2,50.4 54.2,48.6 55,47.8 67.7,47.8 v68.3,47.2
HMI_BUTTON_CPU_5  (via drill 0.35)
  Top 0.178: U1.59 69.5,47 v68.5,48 | U3.3 54.73,49.17 v54.8,49.1
  Bottom 0.178: v68.5,48 68.2,48.3 55.6,48.3 v54.8,49.1
HMI_BUTTON_CPU_6  (via drill 0.35)
  Top 0.178: U3.6 58.93,49.17 v59,49.1 | v69.5,50 69.85,50.35 R69.1 R68.2
  Bottom 0.178: v59,49.1 59.3,48.8 68.3,48.8 v69.5,50
HMI_BUTTON_MCU_FCT_6
  Top 0.178: U1.58 70,47 70.5,47.5 R69.2
HMI_LCD_BACKLIGHT
  Top 0.178: U1.56 71,45.5 72,46.5 74.5,46.5 74.9,46.9 R70.2
HMI_LCD_LED+
  Top 0.406: J8.1 75.5,57 R28.2 75.05,55 T1.3
HMI_LCD_SCL  (via drill 0.35)
  Top 0.178: U4.3 83.75,55.5 v85.5,55.5 | v85.5,55.5 R27.2 | J8.6 v81.85,64.15 | U1.49 78,42 78.5,42.5 v78.5,49 | v85.5,49.5 v85.5,55.5
  Bottom 0.178: v81.85,64.15 83.85,64.15 84.5,63.5 84.5,59.5 85.5,58.5 v85.5,55.5 | v78.5,49 85,49 v85.5,49.5
HMI_LCD_SDA  (via drill 0.35)
  Top 0.178: R26.2 83.7,57.65 U4.4 83.65,58.15 v84,58.5 | v81,58.5 80.58,58.92 J8.5 | U1.48 79.2,41.5 79.7,42 v79.7,47.5 | v84,47.5 v84,54
  Bottom 0.178: v81,58.5 v84,58.5 v84,54 | v79.7,47.5 v84,47.5
HMI_LCD_VO
  Top 0.406: U4.5 83,60.38 J8.7
HMI_LED_1  (via drill 0.35)
  Top 0.178: U1.73 v62.5,52 | v60.9,53.6 R62.1
  Bottom 0.178: v62.5,52 v60.9,53.6
HMI_LED_2  (via drill 0.35)
  Top 0.178: U1.70 v64,51.5 | v63.5,54.15 R64.2
  Bottom 0.178: v64,51.5 63.5,52 v63.5,54.15
HMI_LED_3  (via drill 0.35)
  Top 0.178: U1.69 64.5,51 v65,51.5 | v66,53.5 R63.1
  Bottom 0.178: v65,51.5 66,52.5 v66,53.5
HMI_LED_4  (via drill 0.35)
  Top 0.178: U1.68 65,50 v65.5,50.5 | v68.5,53.5 R65.2
  Bottom 0.178: v65.5,50.5 v68.5,53.5
ISP_RXDO  (via drill 0.35)
  Top 0.178: J16.5 39.69,63.31 40.5,62.5 40.5,51.5 46.5,45.5 46.5,40 v47,39.5 | U1.99 58,31 55.5,28.5 v49,28.5
  Bottom 0.178: v49,28.5 49,37.5 v47,39.5
ISP_TXDO  (via drill 0.35)
  Top 0.178: J16.4 39.23,60.77 40,60 40,51 46,45 46,39 v46.5,38.5 | U1.98 57.5,31.5 55.7,29.7 v48,29.7
  Bottom 0.178: v48,29.7 48,37 v46.5,38.5
JTAG_TCK  (via drill 0.35)  (1 unrouted)
  Top 0.178: v47.5,25.5 47.7,25.3 62.3,25.3 63.5,26.5 U1.5
  Bottom 0.178: J5.8 34.04,25 | 36.5,25 37,25.5 v47.5,25.5
JTAG_TDI  (via drill 0.35)  (1 unrouted)
  Top 0.178: U1.2 62,28 61,27 48.9,27 v48.6,26.7
  Bottom 0.178: J5.7 29.96,24.96 | v48.6,26.7 36.7,26.7 36.5,26.5 31.5,26.5
JTAG_TDO  (via drill 0.35)  (1 unrouted)
  Top 0.178: U1.1 61.5,28 61,27.5 47.4,27.5 v46,26.1
  Bottom 0.178: 30.92,22.42 31.5,23 31.5,25.5 32,26 45.9,26 v46,26.1
JTAG_TMS  (via drill 0.35)  (1 unrouted)
  Top 0.178: v49.5,26.4 49.6,26.5 61.5,26.5 62.5,27.5 U1.3
  Bottom 0.178: J5.10 34.08,22.5 | 36.5,22.5 38.9,24.9 49,24.9 49.5,25.4 v49.5,26.4
L1_1  (via drill 0.35)
  Top 0.178: v30.5,61.5 31.5,60.5 31.5,44 32.68,42.82 U$2.22
  Bottom 0.178: P1.L2 26.6,63.9 29,61.5 v30.5,61.5
L1_2
  Top 0.178: U$2.21 33.68,43.32 32.5,44.5 32.5,62.5 31.1,63.9 P1.L4
MII_MODE
  Top 0.178: R8.2 35.57,35.57 U$2.32
N$1
  Top 0.178: J7.3 64.04,59.04 63.5,58.5 R64.1
N$2
  Top 0.178: R65.1 68.5,58 66.58,59.92 J7.5
N$3  (via drill 0.35, 0.5)
  Top 0.178: 67,15.65 R10.2 66.95,15.7 v66.1,15.7 64.55,15.7 C14.1 | R9.1 72.2,16.2 v72.5,16.5
  Bottom 0.178: v72.5,16.5 66.9,16.5 v66.1,15.7
N$4
  Top 0.178: R7.1 33.8,44.7 34,44.5 35,44.5 35.07,44.43 U$2.20
N$5  (via drill 0.35)
  Top 0.178: SW2.4 SW2.3 v90.5,39
  Bottom 0.178: R71.2 R72.2 89.85,44.1 R67.1 90.05,39.45 v90.5,39
N$6
  Top 0.406: SJ1.1 76,13.95 U$5.G1 72.09,5.6 54.91,5.6 U$5.G2 51.1,9.6 SJ2.1
N$7
  Top 0.178: R70.1 74.06,52.09 T1.1
N$8
  Top 0.178: P1.L1 17.62,62.38 19,61 19,55 14.5,50.5 R2.1
N$9
  Top 0.178: P1.L3 25,61.59 25,58 29.05,53.95 R1.1
N$10  (via drill 0.5)
  other vias: 41,30
N$11
  Top 0.178: J3.2 31.27,8.12 R16.1
N$12
  Top 0.178: J4.3 39.23,8.02 R19.1
N$13
  Top 0.178: J4.2 41.77,8.12 R17.1
N$14
  Top 0.178: J3.3 28.73,8.12 R18.1
N$15
  Top 0.178: U$6.2 122.85,24.2 R24.2 122.7,24.05 R22.1
N$16
  Top 0.178: U$6.3 124.05,24.85 123.9,25 123.9,27.5 123.5,27.9 R23.1
N$17  (via drill 0.35)
  Top 0.178: R29.2 v43.6,54.5 43.6,52.9 44.5,52 50.2,52 50.7,51.5 50.7,50.2 50.33,49.83 U2.7
  Bottom 0.178: C17.1 43.65,54.45 v43.6,54.5
N$18
  Top 0.178: LED1.C 120.55,21 R25.1
N$19  (via drill 0.35)
  Top 0.178: U2.5 50.84,48.53 51.4,49.1 51.4,51.9 50.3,53 46,53 45.8,53.2 v45.8,54.5 R30.2
  Bottom 0.178: C18.1 v45.8,54.5
N$20  (via drill 0.35)
  Top 0.178: v48.4,54.3 48.4,55.6 R31.2 | U2.2 46.67,49.83 v47,49.5
  Bottom 0.178: v48.4,54.3 48.45,54.25 C19.1 47.35,53.35 47,53 v47,49.5 47,49
N$21
  Bottom 0.178: J9.2 R38.1
N$22  (via drill 0.35)
  Top 0.178: R66.1 26.38,33.65 U5.7 25.14,33.63 v24,32.5 | JP1.1 v12.5,38.6
  Bottom 0.178: v12.5,38.6 12.5,36 17,31.5 23,31.5 v24,32.5
N$23
  Bottom 0.178: R37.1 J10.2
N$24  (via drill 0.35)
  Top 0.178: v96.5,9.5 97.35,8.65 K1.1
  Bottom 0.178: R38.2 94.65,9.5 v96.5,9.5
N$25  (via drill 0.35)
  Top 0.178: U3.7 57.83,49.83 58.5,50.5 58.5,51.5 58,52 52.7,52 50.6,54.1 v50.6,54.3 50.6,55.6 R32.2
  Bottom 0.178: C20.1 50.7,54.2 v50.6,54.3
N$26  (via drill 0.35)
  Top 0.178: U3.5 56.36,48.5 59.5,48.5 60,49 60,51.5 58.5,53 54,53 52.8,54.2 v52.8,54.3 52.8,55.6 R33.2
  Bottom 0.178: C21.1 52.85,54.25 v52.8,54.3
N$27  (via drill 0.35)
  Top 0.178: R34.2 55.4,54.4 v55.5,54.3 | U3.2 54.93,49.83 v55,49.9
  Bottom 0.178: v55,49.9 55,52.85 55.5,53.35 C22.1 55.8,54 v55.5,54.3
N$28  (via drill 0.35)
  Top 0.178: v117.2,9.3 117.25,9.3 K3.1
  Bottom 0.178: R45.2 117.15,9.35 v117.2,9.3
N$29
  Top 0.178: K1.6 93.6,13.6 95.8,15.8 K1.4
N$30
  Top 0.178: R42.1 R41.2 81.15,17.3 K2.5
N$32
  Bottom 0.178: R45.1 115.5,7 114.23,5.73 J12.2
N$33  (via drill 0.35)
  Top 0.178: v106.3,9.3 106.75,9.3 K4.1
  Bottom 0.178: R48.2 106.25,9.35 v106.3,9.3
N$34
  Top 0.178: K3.5 113.15,15.8 R47.1 R46.2
N$35
  Top 0.178: J15.2 18.54,10.61 R57.1
  Bottom 0.178: R56.2 18.5,5.04 J15.2
N$36
  Top 0.178: R50.1 R49.2 102.15,17.8 K4.5
N$37
  Bottom 0.178: R48.1 105,7 103.73,5.73 J13.2
N$38  (via drill 0.35)
  Top 0.178: v84.5,21 R42.2 84.65,20 v86,20 | U6.3 89.84,20.34 v89.5,20
  Bottom 0.178: C25.1 v84.5,21 | v89.5,20 v86,20
N$39  (via drill 0.35)
  Top 0.178: v94,21 R40.2 92.85,19.85 v92,19 | U6.1 87.96,19.54 v88.5,19
  Bottom 0.178: C26.1 v94,21 | v88.5,19 v92,19
N$40
  Top 0.178: J15.3 R59.1
  Bottom 0.178: R61.2 J15.3
N$41  (via drill 0.35)
  Top 0.178: v115.5,20.8 R47.2 115.45,19.8 v113.7,19.8 | U7.1 109.56,20.74 v110.2,20.1
  Bottom 0.178: C28.1 v115.5,20.8 | v110.2,20.1 110.5,19.8 v113.7,19.8
N$42  (via drill 0.35)
  Top 0.178: v105,21 R50.2 106.35,19.85 v106.5,20 | U7.3 111.44,20.84 v111.4,20.8
  Bottom 0.178: C27.1 v105,21 | v111.4,20.8 107.3,20.8 v106.5,20
N$43  (via drill 0.5)
  Top 0.406: D2.C 105.9,62.3 C41.2 109.35,62.35 v109.5,62.5 | U8.1 110.03,65.97 v109.5,66.5
  Bottom 0.406: v109.5,66.5 v109.5,62.5
N$44
  Top 0.406: R52.1 LED3.A
N$45
  Top 0.406: R51.1 LED2.C
N$46
  Top 0.178: J15.4 13.46,10.61 R60.1
  Bottom 0.178: R58.2 13.5,5.04 J15.4
N$47
  Top 0.406: C42.1 R53.2
N$48
  Top 0.406: U8.7 117.17,65.33 117.5,65 117.5,62 117,61.5 C42.2
N$49
  Top 0.406: U8.3 107.17,64.67 | 107.17,64.67 106.55,64.05 C41.1 | 107.17,64.67 106,65.84 D3.C 105.73,66.6 L2.1
N$50
  Top 0.406: R54.1 LED4.A
N$51
  Top 0.406: R55.1 LED5.A
N$52  (via drill 0.35)
  Top 0.178: U11.6 13.88,15.88 13.5,15.5 v13.5,13.8 R60.2
  Bottom 0.178: C54.1 v13.5,13.8
N$53  (via drill 0.35)
  Top 0.178: U11.3 17.38,15.88 16,14.5 v16,13.8 R59.2
  Bottom 0.178: C47.1 v16,13.8
N$54  (via drill 0.35)
  Top 0.178: R57.2 18.48,12.37 18.48,13.78 v18.5,13.8 18.5,14.56 U11.1
  Bottom 0.178: C46.1 v18.5,13.8
N$55  (via drill 0.35)
  Top 0.178: v85.5,9.5 86,9.5 86.85,8.65 K2.1
  Bottom 0.178: R37.2 84.15,9.5 v85.5,9.5
N$57
  Top 0.178: K2.6 83.1,13.6 85.3,15.8 K2.4
N$58
  Top 0.178: R39.2 R40.1 93.65,18.15 91.65,16.15 K1.5
N$59
  Top 0.178: K4.6 103.6,13.6 105.8,15.8 K4.4
N$60
  Top 0.178: K3.6 114.6,13.6 116.8,15.8 K3.4
N$63
  Top 0.178: R62.2 60.9,57.9 61.5,58.5 62,58.5 62.77,59.27 J7.2
N$64
  Top 0.178: J7.4 65.31,59.19 66,58.5 R63.2
N$65
  Top 0.178: J1.2 7.92,27.77 R12.2 R13.2
N$66
  Top 0.178: J2.2 7.92,33.77 R14.1 R15.1
N$67
  Top 0.178: J11.2 8.15,19.77 R43.1 R44.1
PFBOUT  (via drill 0.35, 0.5)
  Top 0.178: U$2.19 35.57,44.63 v34.9,45.3
  Top 0.305: U$2.30 33.82,38.82 v33.5,38.5 | U$2.16 37.07,44.83 v36.9,45
  Bottom 0.305: C11.1 v33.5,38.5
  Bottom 0.406: C6.1 34.25,44.65 v34.9,45.3 | v36.9,45 38.5,45 C10.1 | C7.+ C11.1
  pour Route3: 39.7,37 39.7,46 32.6,46 32.6,37
RESET  (via drill 0.35)
  Top 0.178: R68.1 v72.8,47.7 | v72.8,42.5 v72.8,37.6 | v72.8,34.8 72.2,34.2 69.9,34.2 69.5,33.8 U1.17 | SW1.4 SW1.3 | v88.5,35 v99.5,35 101.5,37 101.5,40.5 102.25,41.25 SW1.4 | 103.2,41.8 SW1.4
  Bottom 0.178: v72.8,47.7 v72.8,42.5 | v72.8,34.8 v72.8,37.6 85.9,37.6 v88.5,35 | R11.1 v99.5,35
RTCX1  (via drill 0.35)
  Top 0.178: U1.16 69,27.5 v68.5,27 68.5,26.5 68.4,26.4 68.4,25.95 X1.1
  Bottom 0.178: C29.1 v68.5,27
RTCX2  (via drill 0.35)
  Top 0.178: X1.2 70.7,26.05 v70.7,27.1 70,27.8 U1.18
  Bottom 0.178: C30.1 v70.7,27.1
USB_D_N  (via drill 0.35)
  Top 0.178: U1.30 v77,32.5 | v96.8,29.8 v116.7,29.8 | v118.6,27.9 R23.2
  Bottom 0.178: v77,32.5 78,31.5 78,30.5 78.7,29.8 v96.8,29.8 | v116.7,29.8 v118.6,27.9
USB_D_P  (via drill 0.35)
  Top 0.178: U1.29 76.5,32 v77,31.5 | v99.1,29.1 v115.4,29.1 | v118.75,25.75 R22.2
  Bottom 0.178: v77,31.5 77,30 77.9,29.1 v99.1,29.1 | v115.4,29.1 v118.75,25.75
USB_UP_LED  (via drill 0.35)
  Top 0.178: R25.2 119.05,23.95 v117,26 | v77,33.5 U1.32 | v97,31 v110.5,31
  Bottom 0.178: v117,26 112,31 v110.5,31 | v97,31 79,31 78.5,31.5 78.5,32 v77,33.5
USB_V_BUS  (via drill 0.5)
  Top 0.406: U$6.1 124.55,23.55 v124,23 | U1.21 71.5,31.5 v72,32
  Route2 0.406: v124,23 120,23 118,25 83,25 79,29 72.5,29 71.5,30 71.5,31.5 v72,32
VBAT+  (via drill 0.35, 0.5)
  Top 0.406: U1.19 70.5,32.5 71,33 v71.5,33 | U$14.+2 8,61.4 9.5,59.9 9.5,46.9 8.13,45.53 U$14.+1 6,42.5 v7,41.5
  Route3 0.406: v7,41.5 11,41.5 21,31.5 49,31.5 50.5,33 v71.5,33
VIN
  pour Top: 122.5,40 133,40 133,63.5 118,63.5 118,50 122.5,50
XTAL1
  Top 0.178: U1.22 72,27.5 72.95,26.55 U$10.3